# Altium schematic sheet Power.SchDoc
size A4; SheetNumber: 2; SheetTotal: 2
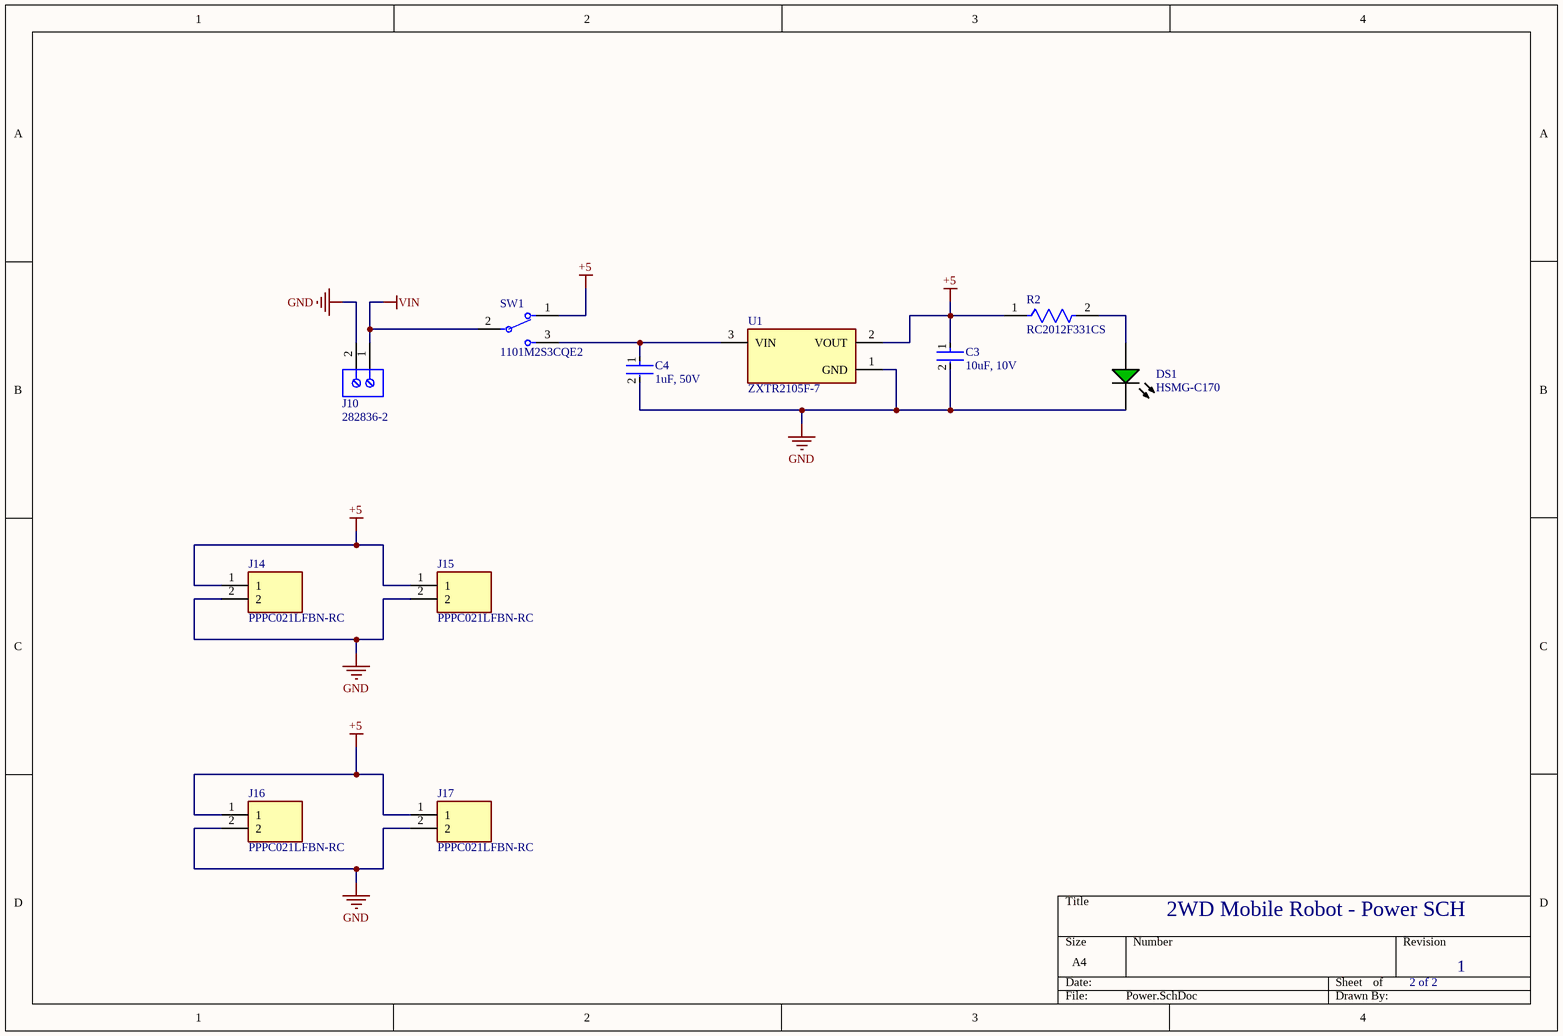
[diagram p0: Power.SchDoc]

## Parts
C3  10uF, 10V  [FP-C0805C-DG-MFG]
C4  1uF, 50V  [FP-C2012-125-0_2-IPC_A]
DS1  HSMG-C170  [AVAG-HSMX-C170_V]
J10  282836-2  [TECO-282836-2_V]
J14  PPPC021LFBN-RC  [RHDR2W80P0X254_1X2_558X254X850P]
J15  PPPC021LFBN-RC  [RHDR2W80P0X254_1X2_558X254X850P]
J16  PPPC021LFBN-RC  [RHDR2W80P0X254_1X2_558X254X850P]
J17  PPPC021LFBN-RC  [RHDR2W80P0X254_1X2_558X254X850P]
R2  RC2012F331CS  [FP-RC2012-MFG]
SW1  1101M2S3CQE2  [FP-1101M2S3CQE2-MFG]
U1  ZXTR2105F-7  [FP-SOT23-MFG]

## Nets
+5: C3.1 J14.1 J15.1 J16.1 J17.1 R2.1 SW1.1 U1.2(VOUT)
GND: C3.2 C4.2 DS1.2(K) J10.2 J14.2 J15.2 J16.2 J17.2 U1.1(GND)
VIN: J10.1 SW1.2(COMM)
NetC4_1: C4.1 SW1.3 U1.3(VIN)
NetDS1_1: DS1.1(A) R2.2

## Notes on the sheet
- 2WD Mobile Robot - Power SCH
- 2 of 2
- 1

## Library data of the parts
C3 = CMP-2007-03243-2: CAP CER 10UF 10V X5R 0805; Manufacturer Part Number: C0805C106K8PACTU; Manufacturer: Kemet; 3DS Part Number: 220-00001; Manufacturer Product Number: C0805C106K8PAC7800; Tolerance: 10%; Temperature Coefficient: 15%; Material: Ceramic; Device Class L2: Capacitors; Device Class L1: Passive Components; ComponentLink2URL: https://content.kemet.com/datasheets/KEM_C1006_X5R_SMD.pdf; Height: 1.4mm; Lead Free: Yes; Digikey Description: CAP CER 10UF 10V X5R 0805; Octopart: https://octopart.com/c0805c106k8pactu-kemet-98697; Capacitance: 10uF; Value: 10uF; Temperature Range Low: -55°C; Temperature: -55°C to +85°C; Automotive: No; Mouser Description: CAP CER 10UF 10V X5R 0805; Ipc Land Pattern Name: CAPC200125X125; Temperature Range High: +85°C; Voltage: 10V; RoHS: TRUE; Device Class L3: Ceramic Capacitors; ComponentLink2Description: Datasheet; Voltage Rating: 10V; Package: C0805C-DG; Temperature Characteristic: X5R; Category: Cap
C4 = CMP-08246-005414-1: Multilayer Ceramic Capacitors 1μF ±10% 50V JB SMD 0805; Manufacturer Product Number: C2012JB1H105K125AB; Packaging: Tape and Reel; Resistor Type: Ceramic; Width: 0.049inch; Dielectric Material: Ceramic; Height: 1.25mm; Lead Free: Lead Free; Case Code (Metric): 2012; Thickness: 0.057inch; Mount: Surface Mount; Voltage Rating: 50V; Length: 0.079inch; Voltage Rating (DC): 50V; Max Operating Temperature: 85°C; Series: C; Min Operating Temperature: -25°C; Termination: SMD/SMT; Package Quantity: 2000; Tolerance: 10%; Case/Package: 0805; RoHS Compliant: Yes; Capacitance: 1uF; Case Code (Imperial): 0805
DS1 = CMP-2000-05062-1: Chip LED, Green, 2.2 V, -40 to 85 degC, 2-Pin SMD, Pb-Free, Tape and Reel; Manufacturer: Avago; No. of Pins: 2; Peak Wavelength: 570nm; SVHC: NoSVHC(16-Jun-2014); Dominant Wavelength: 572nm; Forward Current If: 20mA; Viewing Angle: 170deg; Lens Shape: Rectangular; PIV Max: 5V; External Width: 1.25mm; LED Type: Standard; External Depth: 0.8mm; Opto Mounting Orientation: Top; Luminous Intensity: 15mcd; Luminous Intensity Min: 4mcd; Forward Voltage VF Max: 2.6V; External Length / Height: 2mm; Bulb Size: 1.25mmx1.4mm; Light Area Height: 1mm; Voltage Vf Typ: 2.2V; Operating Temperature Max: 85degC; Datasheet Version: Oct-08; MSL: MSL2A-4weeks; Peak Forward Current: 20mA; Package Description: 2-Pin Surface Mount Device, Body 2 x 1.25 mm, Height 0.8 mm; Datasheet URL: https://datasheet.ciiva.com/29280/180495-da-01-en-chip-led-hsmg-c170-gelb-gruen-29280971.pdf; Storage Temperature Min: -40degC; LED Colour: Green; Wavelength Typ: 570nm; Mounting Type: SMD; Forward Current If Max: 20mA; Dominant Wavelength Typ: 572nm; LED Mounting: SMD; Operating Temperature Range: -30degCto+85degC; Operating Temperature Min: -30degC; Manufacturer URL: http://www.avagotech.com/; Packaging: CutTape; Luminous Intensity Typ: 15mcd; Package Reference: HSMX-C170; Storage Temperature Max: 85degC; Opto Case Style: SMD; Forward Voltage: 2.2V
J10 = CMP-1684-00017-1: Female Header, Pitch 5 mm, 1 x 2 Position, Height 10 mm, Tail Length 3.5 mm, Rohs, Bulk; Manufacturer: TE Connectivity; Wire Gauge: 16-30AWG; Product Training Modules: Wire-to-BoardEurostyleTerminalBlocks; Clamp Material - Plating: Brass-NickelPlated; Voltage: 300V; Mating Orientation: HorizontalwithBoard; Current: 13.5A; Pitch: 0.197"(5.00mm); Screw Thread: M3; 3D Model: 282836-2.pdf; Other Names: 5ULV-02B / A98076; Dynamic Catalog: BuchananSeries; Number of Levels: 1; Torque - Screw: 0.68Nm(6Lb-In); Featured Product: EurostyleTerminalBlockConnectors; Positions Per Level: 2; Wire Termination: Screw-RisingCageClamp; Datasheet URL: http://www.te.com.cn/commerce/DocumentDelivery/DDEController?Action=showdoc&DocId=Catalog+Section%7F1308389_EUROSTYLE_TERMINAL_BLOCKS%7F0607%7Fpdf%7FEnglish%7FENG_CS_1308389_EUROSTYLE_TERMINAL_BLOCKS_0607.pdf%7F282836-2; Color: Green; Family: TerminalBlocks-WiretoBoard; RoHS Information: 282836-2StatementofCompliance; Standard Package: 300; Contact Material - Plating: Brass-TinPlated; Manufacturer URL: http://www.te.com; Housing Material: Polyamide(PA66),Nylon6/6; Features: Interlocking(Side); Package Description: Female Header, Pitch 5 mm, 1 x 2 Position, Height 10 mm, Tail Length 3.5 mm; Mounting Type: ThroughHole; Package Reference: THD; Packaging: Bulk; Series: Buchanan; Category: Connectors,Interconnects; Screw Material - Plating: Brass-NickelPlated
J14-J17 = PPPC021LFBN-RC: Connector; Manufacturer_Name: Sullins; Datasheet Link: http://www.sullinscorp.com/drawings/78_P(N)PxCxxxLFBN-RC,_10492-H.pdf; Height: 8.5mm; Manufacturer_Part_Number: PPPC021LFBN-RC
R2 = CMP-13261-000745-1: Res Thick Film 0805 330Ω 1% 0.125W ±100ppm/°C Molded SMD T/R; Voltage Rating (DC): 150V; Resistance: 330R; Power Rating: 125mW; Military Standard: Not; Package Quantity: 1; Radiation Hardening: No; Height: 0.024inch; Case Code (Metric): 2012; Features: Moisture Resistant; Packaging: Tape and Reel; Depth: 1.25mm; Min Operating Temperature: -55°C; Width: 0.049inch; Temperature Coefficient: 100ppm/°C; Lead Free: Lead Free; Length: 0.079inch; Tolerance: 1%; Contact Plating: Tin; Case Code (Imperial): 0805; Composition: Thick Film; Number of Terminations: 2; Max Operating Temperature: 155°C; Max Power Dissipation: 125mW; Case/Package: 0805
SW1 = CMP-10038-000019-1: SWITCH SLIDE SPDT 6A 120V; Switch Travel: 2.16mm; Number of Positions: 3; Number of Poles: 1; Approvals: UL; Actuator Length: 5.08mm; Voltage Rating (DC): 28V; Max Voltage Rating (AC): 250V; Insulation Resistance: 1GR; Body Material: Stainless Steel; Actuator Type: Standard; Contact Resistance: 10mR; Switch Function: On-On; Actuator Material: Nylon; Actuator Color: Black; Electrical Life: 40000Cycles; Termination: PC Pins; Packaging: Bulk; Housing Material: Stainless Steel; Flammability Rating: UL94 V-0; Series: 1000; Contact Current Rating: 6A; Length: 12.7mm; Depth: 6.6mm; Orientation: Vertical; Max Current Rating: 6A; Max Operating Temperature: 65°C; Throw Configuration: SPDT; REACH SVHC: No SVHC; Contact Material: Copper; Max Voltage Rating (DC): 28V; Lead Free: Lead Free; Current Rating: 6A; Voltage Rating (AC): 120V; Contact Plating: Silver; Package Quantity: 1; Min Operating Temperature: -30°C; Mount: Through Hole
U1 = CMP-12756-000045-1: IC REG LINEAR 5V 89MA SOT23; Number of Outputs: 1; Max Power Dissipation: 625mW; Output Type: Fixed; Output Current: 15mA; Max Input Voltage: 60V; Min Input Voltage: 7V; Number of Pins: 23; Lead Free: Lead Free; Mount: Surface Mount; Min Operating Temperature: -65°C; RoHS Compliant: Yes; Packaging: Tape and Reel; Max Operating Temperature: 150°C; Package Quantity: 3000; Case/Package: TO-236-3; Number of Regulators: 1; Output Voltage: 5V